# EAGLE design Lumiboard - sensor module (rev B) (EAGLE 6.4)
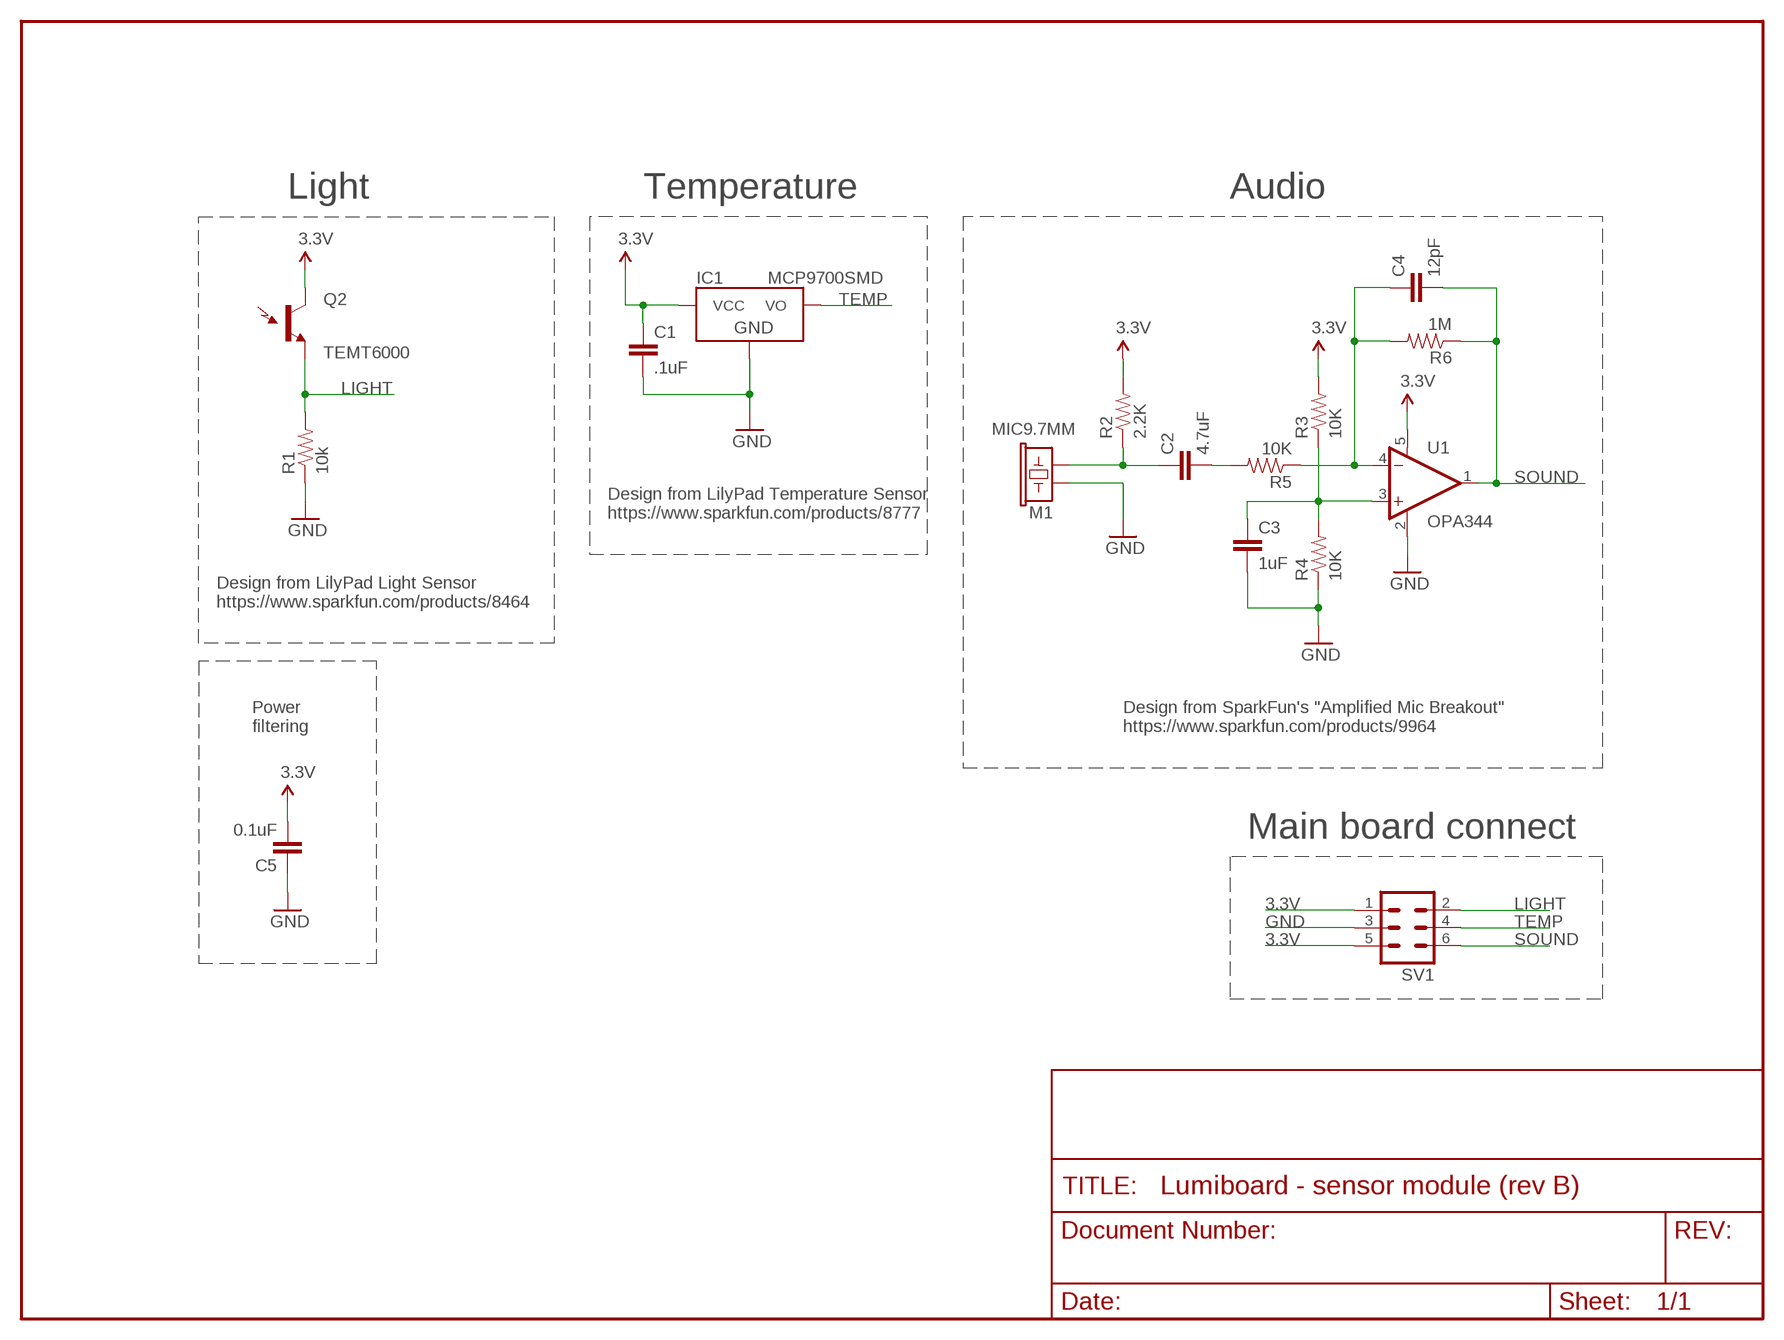
[diagram p0: schematic, sheet 1]

## Parts
C1  .1uF  CAP0805  [0805]
C2  4.7uF  CAP0805  [0805]
C3  1uF  CAP0805  [0805]
C4  12pF  CAP0805  [0805]
C5  0.1uF  CAP0805  [0805]
IC1  MCP9700SMD  [SOT23-3]
M1  MIC9.7MM  [MIC-9.7MM]
Q2  TEMT6000  [TEMT6000-SEN]
R1  10k  RESISTOR0805-RES  [0805]
R2  2.2K  RESISTOR0805-RES  [0805]
R3  10K  RESISTOR0805-RES  [0805]
R4  10K  RESISTOR0805-RES  [0805]
R5  10K  RESISTOR0805-RES  [0805]
R6  1M  RESISTOR0805-RES  [0805]
SV1  ML6  [ML6]
U1  OPA344  [SOT23-5]

## Nets
3.3V: C1.1 C5.2 IC1.1(VCC) Q2.COLLECTOR(C1) R2.2 R3.2 SV1.1 SV1.5 U1.5(V+)
GND: C1.2 C3.2 C5.1 IC1.3(GND) M1.2 R1.1 R4.1 SV1.3 U1.2(V-)
LIGHT: Q2.EMITTER(E1) R1.2 SV1.2
N$1: C2.1 M1.1 R2.1
N$2: C4.1 R5.1 R6.2 U1.4(-IN)
N$6: C2.2 R5.2
N$7: C3.1 R3.1 R4.2 U1.3(+IN)
SOUND: C4.2 R6.1 SV1.6 U1.1(OUT)
TEMP: IC1.2(VO) SV1.4

## Notes on the sheet
- Light | Temperature | Audio
- Design from LilyPad Temperature Sensor
  https://www.sparkfun.com/products/8777
- Design from LilyPad Light Sensor
  https://www.sparkfun.com/products/8464
- Power
  filtering
- Design from SparkFun's "Amplified Mic Breakout"
  https://www.sparkfun.com/products/9964
- Main board connect

## Library data of the parts
C1 = SparkFun:CAP: Capacitor Standard 0603 ceramic capacitor, and 0.1" leaded capacitor.
C2-C5 = SparkFun-Capacitors:CAP: Capacitor Standard 0603 ceramic capacitor, and 0.1" leaded capacitor.
IC1 = SparkFun:MCP9700
M1 = SparkFun:MIC: Microphone Omni-directional electret microphone. 9.7mm standard diameter.
Q2 = SparkFun:TEMT6000: Ambient Light Sensor Simple light detection sensor. Output varies with light intensity input. Spark Fun Electronics SKU : COM-08348
R1-R6 = SparkFun-Resistors:RESISTOR: Resistor Basic schematic elements and footprints for 0603, 1206, and PTH resistors.
SV1 = con-harting-ml:ML6: HARTING; OC_FARNELL: unknown; OC_NEWARK: unknown
U1 = SparkFun:OPA344

## Board
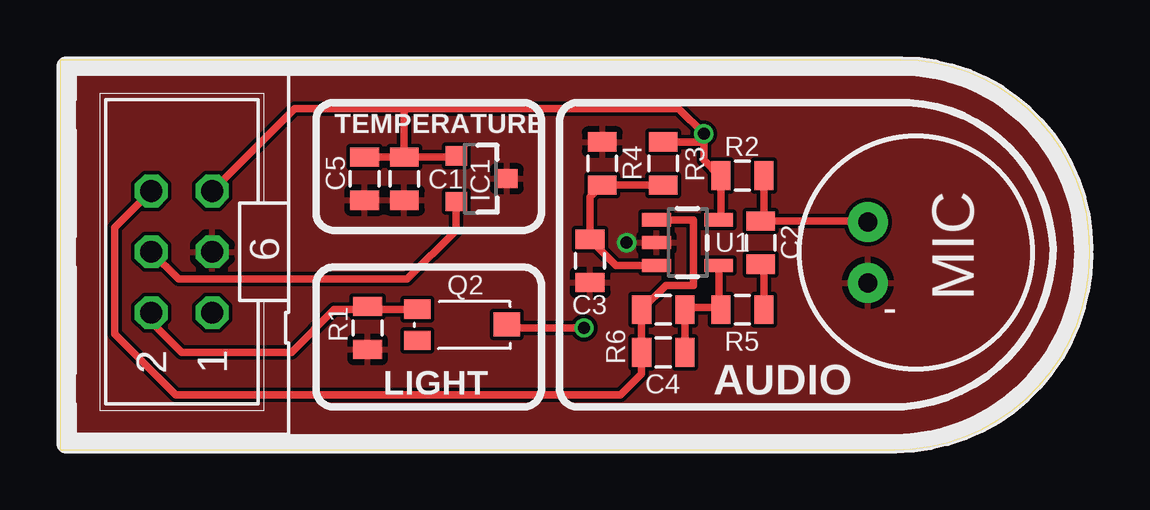
[diagram p1: board, top side]
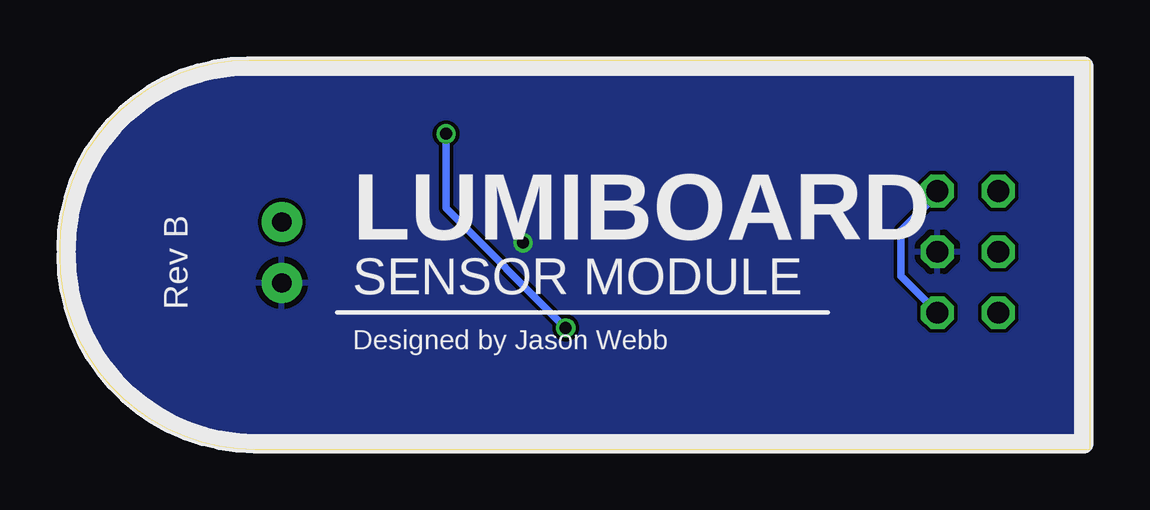
[diagram p2: board, bottom side, seen from below]

Size 42.93 x 16.26 mm. Coordinates in mm from the lower left corner, seen from the top.
Outline: 0,0 34.8,0 arc90 42.93,8.13 42.93,8.38 arc90 35.05,16.26 0,16.26 0,0
Copper layers (1*2*15*16): Top 0.035mm / dielectric 0.2mm / layer 2 0.0175mm / dielectric 1.1mm / layer 15 0.0175mm / dielectric 0.2mm / Bottom 0.035mm
Design rules "SeeedStudio_DRU_no_angle_20130527": minimum track width 6mil, minimum drill 12mil, track to track 6mil, track to pad 6mil, pad to pad 6mil, via to via 6mil, smd to smd 0mil, copper to edge 10mil, drill to drill 10mil, minimum pad ring 6mil, minimum via ring 6mil, stop-mask expansion 2mil, vias tented up to drill 25mil, thermal gap 10mil

### Footprints (pad centres in the part's own frame; a part is rotated, then mirrored left to right if it is on the bottom)
0805 = smd 0.8 x 1.2: 1 -0.9,0; 2 0.9,0
SOT23-3 = smd 0.8 x 0.9: 1 -0.95,-1; 2 0.95,-1; 3 0,1.1
MIC-9.7MM = drill 0.8 pad 1.676: 1 -2,1.27; 2 -2,-1.27
TEMT6000-SEN = smd 1.1 x 0.8: BASE -1.87,-0.65; EMITTER -1.87,0.65 | smd 1.1 x 1: COLLECTOR 1.86,0.01
ML6 = drill 0.914 octagon: 1 -2.54,-1.27; 2 -2.54,1.27; 3 0,-1.27; 4 0,1.27; 5 2.54,-1.27; 6 2.54,1.27
SOT23-5 = smd 0.55 x 1.2: 1 -0.95,-1.3; 2 0,-1.3; 3 0.95,-1.3; 4 0.95,1.3; 5 -0.95,1.3

### Placement (x,y rotation side)
C1  14.35,11.3 270 top
C2  29.21,8.64 270 top
C3  22.1,7.87 270 top
C4  25.15,4.06 180 top
C5  12.7,11.3 90 top
IC1  17.53,11.3 270 top
M1  35.68,8.23 0 top
Q2  16.76,5.21 0 top
R1  12.83,5.08 90 top
R2  28.45,11.43 180 top
R3  25.15,11.94 90 top
R4  22.61,11.94 270 top
R5  28.45,5.84 0 top
R6  25.15,5.84 0 top
SV1  5.08,8.26 90 top
U1  26.16,8.64 270 top

### Tracks (layer width: path | path; a pad name or v marks a point on that pad's centre or on a via)
3.3V  (via drill 0.5)
  Top 0.305: Q2.COLLECTOR 18.76,5.08 v21.84,5.08 | C1.1 16.53,12.2 IC1.1 | SV1.5 9.78,14.22 14.48,14.22 | 14.48,14.22 25.79,14.22 v26.83,13.18 26.83,12.84 | R3.2 26.83,12.84 | 26.83,12.84 26.83,12.08 27.52,11.4 R2.2 27.55,9.59 U1.5 | C1.1 14.35,14.1 14.48,14.22 | C5.2 C1.1
  Bottom 0.305: SV1.5 6.35,10.67 7.87,9.14 7.87,7.24 SV1.1 | v26.83,13.18 26.83,10.07 v21.84,5.08
GND  (via drill 0.5)
  other vias: 23.62,8.64
  pour Bottom: -0.25,-0.25 33.53,-0.25 arc90 43.18,7.37 43.18,8.38 arc90 35.05,16.51 -0.25,16.51
  pour Top: -0.25,-0.25 33.53,-0.25 34.8,-0.25 arc90 43.18,8.13 43.18,8.38 arc90 35.05,16.51 -0.25,16.51
LIGHT
  Top 0.305: SV1.2 3.81,5.33 5.08,4.06 9.65,4.06 11.43,5.84 12.69,5.84 R1.2 12.95,5.86 Q2.EMITTER
N$1
  Top 0.305: M1.1 33.64,9.54 C2.1 29.35,9.67 R2.1
N$2
  Top 0.305: U1.4 27.46,5.93 | 27.46,5.93 R5.1 | C4.1 R6.2 26.13,5.93 27.46,5.93
N$6
  Top 0.305: C2.2 29.35,7.6 R5.2
N$7
  Top 0.305: R3.1 R4.2 22.1,10.53 C3.1 23.19,7.69 U1.3
SOUND
  Top 0.305: SV1.6 2.29,9.27 2.29,4.83 4.83,2.29 23.37,2.29 24.25,3.16 C4.2 R6.1 25.26,6.86 26.42,6.86 26.42,9.59 U1.1
TEMP
  Top 0.305: SV1.4 4.95,7.11 14.48,7.11 16.51,9.14 16.51,10.34 IC1.2

### Text on the board
tPlace: TEMPERATURE | AUDIO | LIGHT
bPlace: LUMIBOARD | SENSOR MODULE | Rev B | Designed by Jason Webb
tNames: MIC
tDocu: Size (in): 1.64x0.69" / Size (cm): 4.1656x1.651cm / SMT part pads: 22 / SMT IC pads: 11 / PTH holes: 8